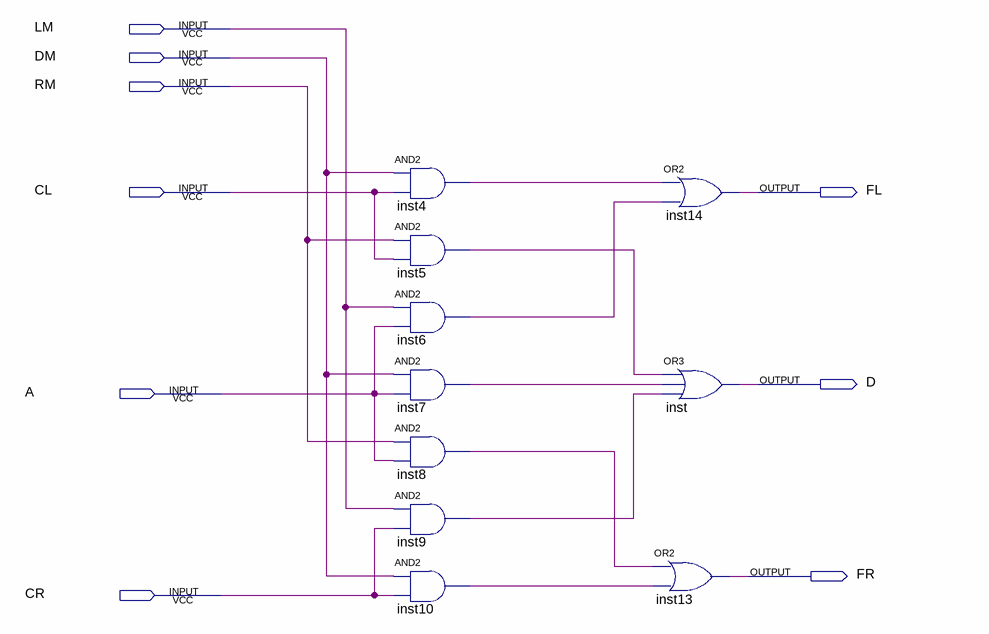
[diagram p0: schematic sheet]
// Quartus schematic SHIFTER.bdf as structural Verilog: 10 symbols, 9 pins
module SHIFTER (
  input  LM,
  input  DM,
  input  RM,
  input  CL,
  input  A,
  input  CR,
  output FL,
  output D,
  output FR
);

  wire inst4_out, inst5_out, inst6_out, inst7_out, inst8_out, inst9_out, inst10_out;

  and inst4 (inst4_out, DM, CL);
  and inst5 (inst5_out, RM, CL);
  and inst6 (inst6_out, LM, A);
  and inst7 (inst7_out, DM, A);
  and inst8 (inst8_out, RM, A);
  and inst9 (inst9_out, LM, CR);
  and inst10 (inst10_out, DM, CR);
  or inst14 (FL, inst4_out, inst6_out);
  or inst (D, inst5_out, inst7_out, inst9_out);
  or inst13 (FR, inst8_out, inst10_out);
endmodule
